# Altium schematic sheet Sheet1.SchDoc
size A4
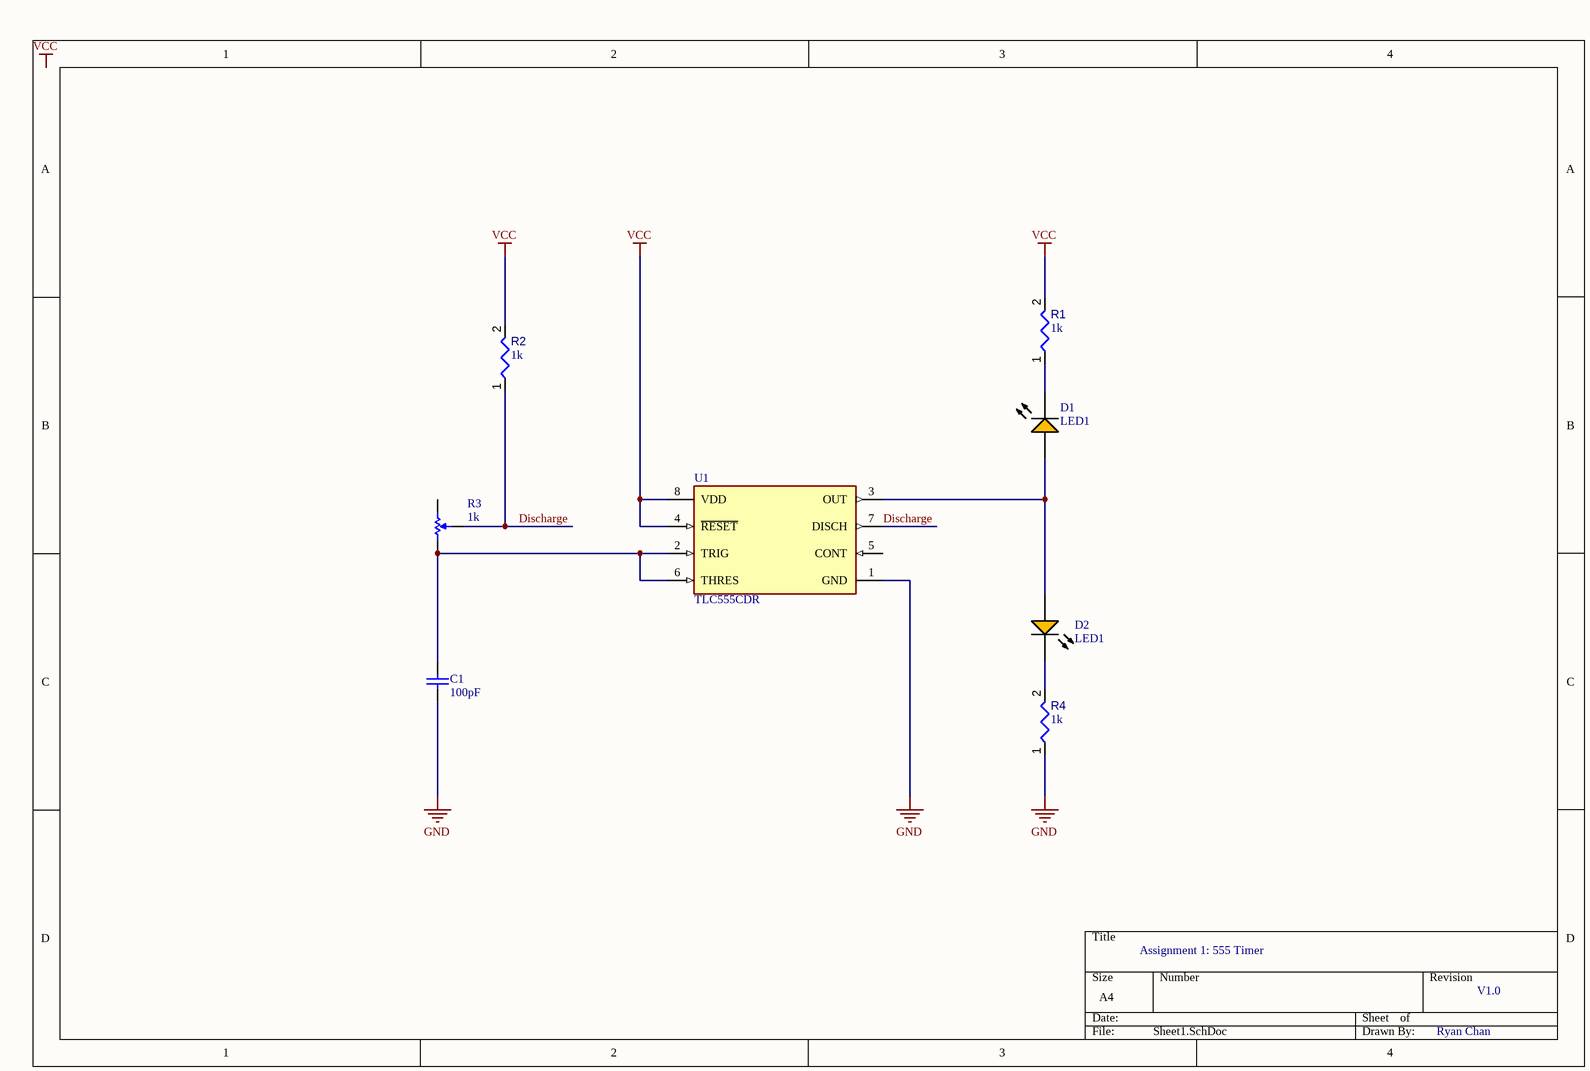
[diagram p0: Sheet1.SchDoc]

## Parts
C1  100pF  [CAPC1608X90X35NL10T15]
D1  LED1  [AVAG-HSMX-C190_V]
D2  LED1  [AVAG-HSMX-C190_V]
R1  R4: 1k  [RESC0402(1005)_L]  (hidden comment: Resistor 1K +/-5 % 0402 63 mW)
R2  R4: 1k  [RESC0402(1005)_L]  (hidden comment: Resistor 1K +/-5 % 0402 63 mW)
R3  1k  [BOUR-3296W-1-3]
R4  R4: 1k  [RESC0402(1005)_L]  (hidden comment: Resistor 1K +/-5 % 0402 63 mW)
U1  TLC555CDR  [FP-D0008A-IPC_B]

## Nets
GND: C1.1 R4.1 U1.1(GND)
VCC: R1.2 R2.2 U1.4(~{RESET}) U1.8(VDD)
Discharge: R2.1 R3.3(TAP) U1.7(DISCH)
NetC1_2: C1.2 R3.1(A) U1.2(TRIG) U1.6(THRES)
NetD1_1: D1.1(A) D2.1(A) U1.3(OUT)
NetD1_2: D1.2(K) R1.1
NetD2_2: D2.2(K) R4.2

Not connected (* = marked no-connect by the designer): R3 2(B); U1 5(CONT)

## Notes on the sheet
- Assignment 1: 555 Timer
- V1.0
- Ryan Chan
- Labels drawn without touching a wire or pin: VCC

## Library data of the parts
C1 = CMP-2006-02595-1: Part Number: GRM1885C1H101JA01D; Manufacturer: Murata
D1 D2 = CMP-007-00011-1: LED Uni-Color Amber, 60 mW, 20 mA, -40 to 85 degC, 2-Pin SMD, RoHS, Tape and Reel; Manufacturer: Avago; Luminous Intensity: 90mcd; Viewing Angle: 170degrees; Illumination Colour: Orange; Forward Current: 20mA; Nominal Vf: 1.9V; Lens Style: Diffused; Power: 60mW; Package Description: 2-Pin Surface Mount Device, Body 1.6 x 0.8 mm, Height 0.9 mm; Mounting Technology: SM; Datasheet URL: http://docs.avagotech.com/docs/AV02-0112EN; Case/Package: 0603; Min Operating Temperature: -40°C; Package Reference: HSMX-C190; Packaging: TapeandReel; Colour: Orange; Package Quantity: 4000; Forward Voltage: 1.9V; Manufacturer URL: http://www.avagotech.com/; Max Operating Temperature: 85°C; Datasheet Version: Sep-10; RoHS Compliant: True; Pins: 2
R1 R2 R4 = CMP-009-00157-2: Chip Resistor, 1 kOhms, +/-5 %, 63 mW, -55 to 155 degC, 0402; Power: 63mW; Tolerance: 5%; Min Operating Temperature: -55°C; Max Operating Temperature: 155°C; Pins: 2; Case/Package: 0402
R3 = CMP-1747-00002-1: Square Trimpot(R) Trimming Potentiometer, 1000 Ohm, -55 to 125 degC, 3-Pin THD, RoHS, Tube; Case\Package: 0603; Tolerance: 1%; Power Rating: 100 mW; Voltage Rating: 75 V; Resistance: 4.7 kohm; ComponentLink2URL: http://www.bourns.com/docs/Product-Datasheets/3296.pdf; Packaging: Tape and Reel; REACH SVHC: Yes; ComponentLink1URL: http://www.bourns.com/; Case Code (Metric): 1608; Width: 0.8 mm; ComponentLink1Description: Manufacturer URL; DatasheetVersion: May-16; Max Operating Temperature: 155 degC; PackageReference: 3296W-1-3; PackageDescription: 3-Pin Through Hole Device, Body 9.53 x 4.83 mm, Pitch 2.54 mm; Weight: 7.1E-05 oz; ComponentLink2Description: Datasheet; RoHSCompliant: true; Min Operating Temperature: -55 degC; Radiation Hardening: No; Case Code (Imperial): 0603; Length: 1.6 mm; Package Quantity: 5000; Pins: 2; Mount: Surface Mount; Height: 0.45 mm
U1 = CMP-04857-000001-1: IC OSC SGL TIMER 2.1MHZ 8-SOIC; Min Supply Voltage: 2V; Number of Channels: 1; Max Power Dissipation: 725mW; Max Supply Voltage: 15V; Low Level Output Current: 100mA; Current Rating: 250A; Quiescent Current: 250uA; Operating Supply Current: 360uA; High Level Output Current: -10mA; Width: 3.91mm; Case/Package: SOIC; Weight: 0.002561oz; Frequency: 2.1MHz; Height: 1.58mm; Package Quantity: 2500; REACH SVHC: No SVHC; Number of Timers/Counters: 1; Lead Free: Lead Free; Number of Pins: 8; Max Operating Temperature: 125°C; Min Operating Temperature: -40°C; Length: 4.9mm; Radiation Hardening: No; Packaging: Tape and Reel; Termination: SMD/SMT; Mount: Surface Mount; Power Dissipation: 725mW